# Altium schematic sheet CCS.SchDoc
size A4; SheetNumber: 1; SheetTotal: 1
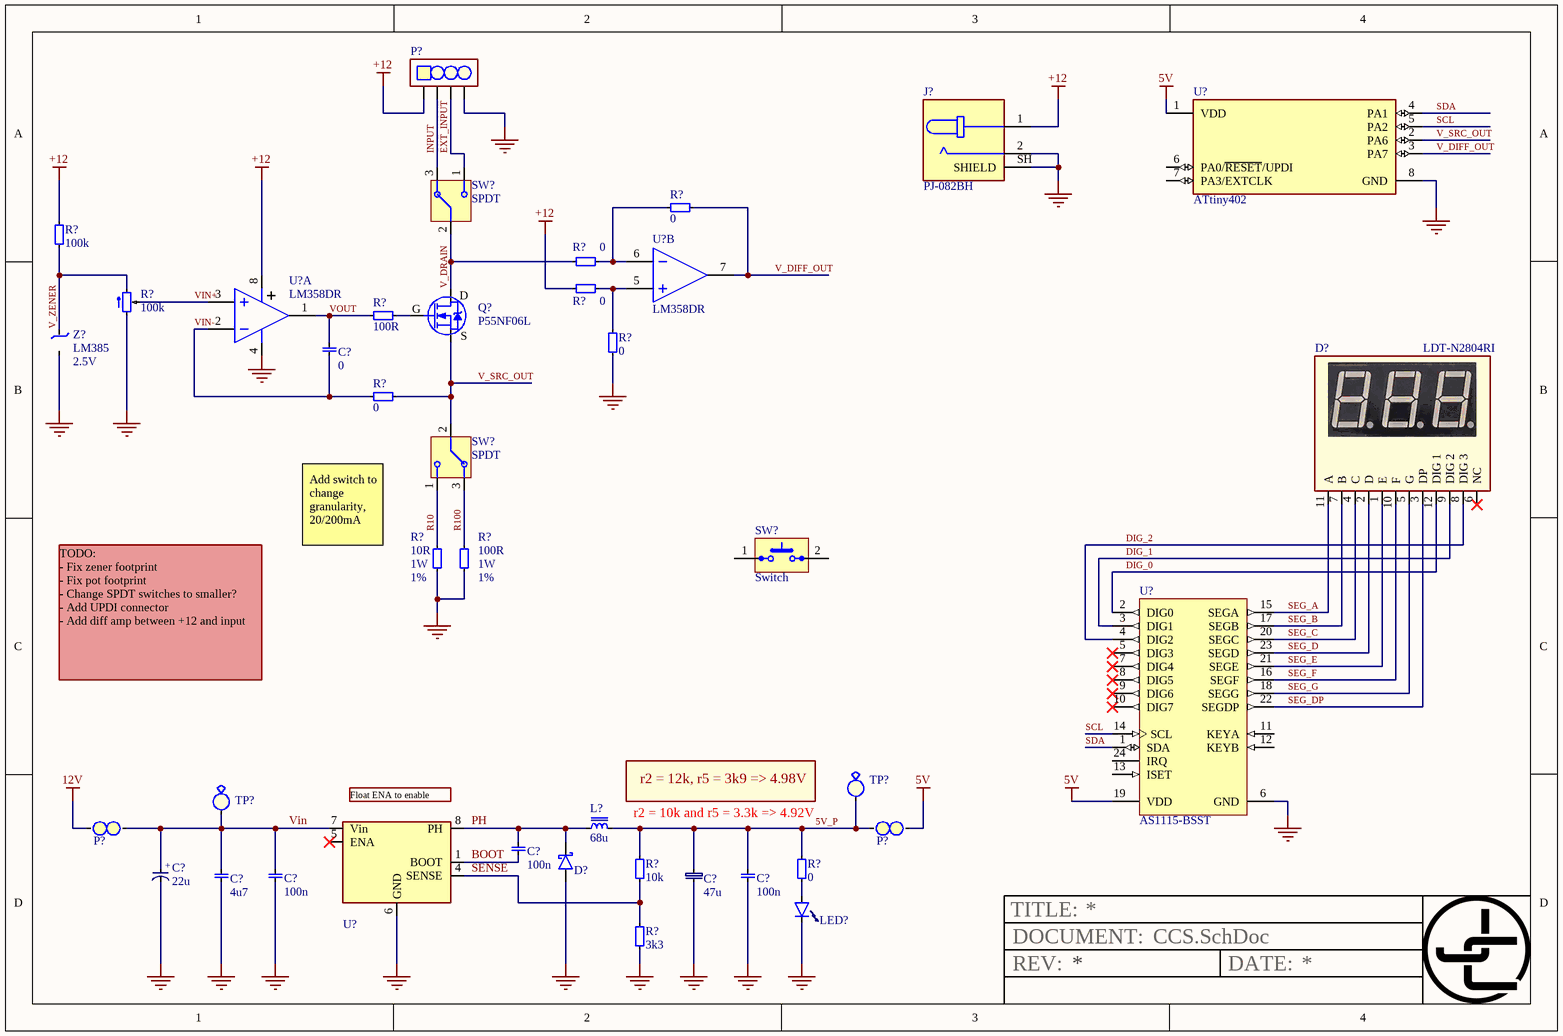
[diagram p0: CCS.SchDoc]

## Parts
(Parts that share a designator on the sheet are numbered #1, #2 ... from top to bottom, then left to right.)
C?#1  value 0  [1210, cap]  (hidden comment: 1210, capacitor)
C?#2  value 100n  [1210, cap]  (hidden comment: 1210, capacitor)
C?#3  value 22u  [EEEFT1E220AR]  (hidden comment: cap, Electrolyt Case B)
C?#4  value 4u7  [1812, cap]  (hidden comment: 1812, capacitor)
C?#5  value 100n  [1210, cap]  (hidden comment: 1210, capacitor)
C?#6  value 47u  [CASE_E]  (hidden comment: cap, Case E)
C?#7  value 100n  [1210, cap]  (hidden comment: 1210, capacitor)
D?#1  LDT-N2804RI  [7SEG_3DIGIT]
D?#2  B340A-E3/61T  [DO-214AC]  (value not drawn)
J?  PJ-082BH  [CUI_PJ-082BH]
L?  value 68u  [MSS1260]  (hidden comment: Coil, MSS1260)
LED?  0603, LED  [0603 LED]  (value not drawn)
P?#1  TBL002A-350-04GY-2GY  [4 POLE BLOCK CONNECTOR]  (value not drawn)
P?#2  1x2 Pin Heade Straight  [padtwo_L]  (value not drawn)
P?#3  1x2 Pin Heade Straight  [padtwo_L]  (value not drawn)
Q?  P55NF06L  [TO-220]
R?#1  value 0  [0603]  (hidden comment: 0603, resistor)
R?#2  value 100k  [0603]  (hidden comment: 0603, resistor)
R?#3  value 0  [0603]  (hidden comment: 0603, resistor)
R?#4  value 0  [0603]  (hidden comment: 0603, resistor)
R?#5  value 100k  [P110KH1]  (hidden comment: Potentiometer)
R?#6  value 100R  [0603]  (hidden comment: 0603, resistor)
R?#7  value 0  [0603]  (hidden comment: 0603, resistor)
R?#8  value 0  [0603]  (hidden comment: 0603, resistor)
R?#9  value 10R  Tolerance: 1%  Power: 1W  [2512, res]  (hidden comment: 2512, resistor)
R?#10  value 100R  Tolerance: 1%  Power: 1W  [2512, res]  (hidden comment: 2512, resistor)
R?#11  value 10k  [0603]  (hidden comment: 0603, resistor)
R?#12  value 0  [0603]  (hidden comment: 0603, resistor)
R?#13  value 3k3  [0603]  (hidden comment: 0603, resistor)
SW?#1  SPDT  [SW_SPDT_SMTS-102-A2]
SW?#2  SPDT  [SW_SPDT_SMTS-102-A2]
SW?#3  Switch  [SW_Tactile_2pin_P5.08mm]
TP?#1  Test Point  [testPoint]  (value not drawn)
TP?#2  Test Point  [testPoint]  (value not drawn)
U?#1  ATtiny402  [SOIC8]
U?#2  LM358DR  [SOIC8]  (part B of 2)
U?#3  LM358DR  [SOIC8]  (part A of 2)
U?#4  AS1115-BSST  [AMS-QSOP-24-8645X3900DE_M]
U?#5  TPS5410  [SOIC8]  (value not drawn)
Z?  value LM385  Reverse voltage: 2.5V  [DO-214AA]  (hidden comment: Zener Diode)

## Nets
5V: P?#3.2 U?#1.1(VDD) U?#4.19(VDD)
12V: P?#2.1
+12: J?.1 P?#1.1 R?#2.0 R?#4.1 U?#3.8(V+)
GND: C?#3.1 C?#4.0 C?#5.0 C?#6.2 C?#7.0 D?#2.2(A) J?.2 J?.SH(SHIELD) LED?.0(Cathode) P?#1.4 R?#5.1 R?#7.1 R?#9.1 R?#10.1 R?#13.1 U?#1.8(GND) U?#3.4(V-) U?#4.6(GND) U?#5.6(GND) Z?.1(Anode)
5V_P: C?#6.1 C?#7.1 L?.1 P?#3.1 R?#11.0 R?#12.0 TP?#1.0
BOOT: C?#2.0 U?#5.1(BOOT)
DIG_0: D?#1.12(DIG_1) U?#4.2(DIG0)
DIG_1: D?#1.9(DIG_2) U?#4.3(DIG1)
DIG_2: D?#1.8(DIG_3) U?#4.4(DIG2)
EXT_INPUT: P?#1.3 SW?#1.1
INPUT: P?#1.2 SW?#1.3
PH: C?#2.1 D?#2.1(K) L?.2 U?#5.8(PH)
R10: R?#9.0 SW?#2.1
R100: R?#10.0 SW?#2.3
SCL: U?#1.5(PA2) U?#4.14(SCL)
SDA: U?#1.4(PA1) U?#4.1(SDA)
SEG_A: D?#1.11(A) U?#4.15(SEGA)
SEG_B: D?#1.7(B) U?#4.17(SEGB)
SEG_C: D?#1.4(C) U?#4.20(SEGC)
SEG_D: D?#1.2(D) U?#4.23(SEGD)
SEG_DP: D?#1.3(DP) U?#4.22(SEGDP)
SEG_E: D?#1.1(E) U?#4.21(SEGE)
SEG_F: D?#1.10(F) U?#4.16(SEGF)
SEG_G: D?#1.5(G) U?#4.18(SEGG)
SENSE: R?#11.1 R?#13.0 U?#5.4(SENSE)
V_DIFF_OUT: R?#1.0 U?#1.3(PA7) U?#2.7(OUT)
V_DRAIN: Q?.2(D) R?#3.1 SW?#1.2
V_SRC_OUT: Q?.3(S) R?#8.0 SW?#2.2 U?#1.2(PA6)
V_ZENER: R?#2.1 R?#5.3 Z?.2(Cathode)
Vin: C?#3.2 C?#4.1 C?#5.1 P?#2.2 TP?#2.0 U?#5.7(Vin)
VIN+: R?#5.2 U?#3.3(IN+)
VIN-: C?#1.0 R?#8.1 U?#3.2(IN-)
VOUT: C?#1.1 R?#6.1 U?#3.1(OUT)
NetLED?_1: LED?.1 R?#12.1
NetQ?_1: Q?.1(G) R?#6.0
NetR?#1_1: R?#1.1 R?#3.0 U?#2.6(IN-)
NetR?#4_0: R?#4.0 R?#7.0 U?#2.5(IN+)

Not connected (* = marked no-connect by the designer): D?#1 6(NC)*; SW?#3 1 2; U?#1 6(PA0/~{RESET}/UPDI) 7(PA3/EXTCLK); U?#4 5(DIG3)* 7(DIG4)* 8(DIG5)* 9(DIG6)* 10(DIG7)* 11(KEYA) 12(KEYB) 13(ISET) 24(IRQ); U?#5 5(ENA)*

## Notes on the sheet
- Add switch to change granularity, 20/200mA
- TODO:
  - Fix zener footprint
  - Fix pot footprint
  - Change SPDT switches to smaller?
  - Add UPDI connector
  - Add diff amp between +12 and input
- (near TP?#1) r2 = 12k, r5 = 3k9 => 4.98V
- (near U?#5) Float ENA to enable
- r2 = 10k and r5 = 3.3k => 4.92V
- TITLE:
- REV:
- DOCUMENT:
- DATE:
- (in symbol cap, Electrolyt Case B) +

## Library data of the parts
C?#1 C?#2 C?#5 C?#7 = 1210, capacitor: Order number: 478-1556-1-ND; Supplier: Digikey
C?#4 = 1812, capacitor: Part Number: C1812C475K5RACTU; Order Number: 399-8255-1-ND
C?#6 = cap, Case E: Tantalum; Part Number: TPSE476K020R0200; Order Number: *
D?#1 = LDT-N2804RI: LED Displays & Accessories Red 3 Digit 7 segment; Manufacturer: Lumex; Manufacturer Part Number: 696-LDT-N2804RI; Forward Voltage: 2V; Element Configuration: Common Cathode; Forward Current: 10mA; Wavelength: 635nm; Power Consumption: 105mW; Luminous Intensity: 6mcd; Color: Red; Weight: 0.01lb; Min Operating Temperature: -30°C; Max Operating Temperature: 85°C; Package Quantity: 22; Illumination Color: Red; Operating Supply Voltage: 2V; Packaging: Bulk; Display Type: Segment; Length: 1inch; Width: 0.5inch; Height: 0.5inch; Reach SVHC Compliant: Yes; RoHS Compliant: Yes; Supplier 1: Mouser; Supplier Part Number 1: 696-LDT-N2804RI
D?#2 = B340A-E3/61T: SchottkydiodE, 40 V, 3 A; Value: Schottky Diode; Farnell: 2335183
J? = Power Jack: 2.5 x 6.5 mm, 10.0 A, Horizontal, Through Hole, Shielded, Dc Power Jack Connector; MF: CUI Devices; Package: None; Availability: In Stock; Value: *; MP: PJ-082BH; CUI_purchase_URL: https://www.cuidevices.com/product/interconnect/connectors/dc-power-connectors/jacks/pj-082bh?utm_source=snapeda.com&utm_medium=referral&utm_campaign=snapedaBOM; Price: None; Purchase-URL: https://pricing.snapeda.com/search/part/PJ-082BH/?ref=eda
L? = Coil, MSS1260: 68 µH, 2.3 A,; Part Number: SRR1260-680M; Order Number: *
P?#1 = 4 Pole Block Connector: 1~24 Poles, Screwless, 45°, 3.50 Pitch, 24~20 (AWG), Terminal Block Connector; Manufacturer: CUI Devices; Supplier 1: Mouser; Manufacturer Part Number: TBL002A-350-04GY-2GY; RoHS: Yes; Category: Terminal Blocks; Stock 1: 1130; Pricing 1: 1=0,94000, 10=0,45400, 50=0,45400, 100=0,43400, 1000=0,35800, 10000=0,26800 (USD); Supplier Part Number 1: 490-TBL002A3504GY2GY
P?#2 P?#3 = 1x2 Pin Heade Straight: 2.54 mm, TH; Value: 1x2 Pin Header
Q? = IRF640: N-channel Power MOSFET; Value: N Channel MOSFET; Farnell: ETF! , 8648298
SW?#1 SW?#2 = Switch SPDT: Toggle switch SPDT
SW?#3 = Tactile switch 2 pin: 2-pin tactile button switch
U?#1 = ATtiny402: MCU 8-Bit ATTINY402 AVR RISC 4KB Flash 1.8V to 5.5V 8-Pin SOIC Tray; Manufacturer: Microchip; Manufacturer Part Number: ATTINY402-SSN; Supplier 1: Mouser; RoHS: Yes; Category: Microcontrollers; Stock 1: 8731; Pricing 1: 1=0,53000, 10=0,53000, 50=0,51000, 100=0,50900, 1000=0,50900, 10000=0,50900 (USD); Supplier Part Number 1: 579-ATTINY402-SSN
U?#2 U?#3 = LM358DR: IC OPAMP GP 700KHZ 8SOIC; Manufacturer: Texas Instruments; Number of Circuits: 2; Nominal Supply Current: 1.2mA; Max Supply Voltage: 32V; Min Supply Voltage: 3V; Operating Supply Voltage: 16V; Slew Rate: 0.3V/µs; Common Mode Rejection Ratio: 65dB; Min Dual Supply Voltage: 1.5V; Output Current: 30mA; Voltage Gain: 100dB; Input Bias Current: 250nA; Input Offset Voltage (Vos): 7mV; Operating Supply Current: 1mA; Amplifier Type: GENERAL PURPOSE; Dual Supply Voltage: 9V; Supplier 1: Mouser; Manufacturer Part Number: LM358DR; RoHS: Yes; Category: Amplifiers - Op Amps, Buffer, Instrumentation; Stock 1: 281120; Pricing 1: 1=0,37000, 10=0,29900, 50=0,29900, 100=0,18500, 1000=0,11500, 10000=0,10400 (USD); Mounting Technology: Surface Mount; Case/Package: SOIC; Pins: 8; Contact Plating: Gold; Min Operating Temperature: 0°C; Max Operating Temperature: 70°C; Packaging: Tape and Reel; Number of Channels: 2; Bandwidth: 700kHz; Gain Bandwidth Product: 700kHz; Package Quantity: 2500; Supply Current: 1.2mA; Max Dual Supply Voltage: 16V; Output Current per Channel: 30mA; Series: -; Technology: BIPOLAR; Number of Elements: 2; Number of Amplifiers: 2; Unity Gain Bandwidth Product: 700kHz; Power Supply Rejection Ratio (PSRR): 65dB; Length: 4.9mm; Width: 3.91mm; Height: 1.58mm; Radiation Hardening: No; Lead Free: Lead Free; RoHS Compliant: Yes; Reach SVHC Compliant: Yes; ComponentLink1URL: https://datasheet.ciiva.com/1795/lm358-1795488.pdf?src-supplier=Digi-Key; ComponentLink1Description: https://datasheet.ciiva.com/1795/lm358-1795488.pdf?src-supplier=Digi-Key; ComponentLink2URL: https://datasheet.ciiva.com/27056/2016330-27056228.pdf?src-supplier=Jameco; ComponentLink2Description: https://datasheet.ciiva.com/27056/2016330-27056228.pdf?src-supplier=Jameco; ComponentLink3URL: https://datasheet.ciiva.com/7709/1874566-7709823.pdf?src-supplier=Element14; ComponentLink3Description: https://datasheet.ciiva.com/7709/1874566-7709823.pdf?src-supplier=Element14; ComponentLink4URL: https://datasheet.ciiva.com/46385/1874566-46385851.pdf?src-supplier=Element14; ComponentLink4Description: https://datasheet.ciiva.com/46385/1874566-46385851.pdf?src-supplier=Element14; ComponentLink5URL: https://datasheet.ciiva.com/46390/1874566-46390414.pdf?src-supplier=Element14; ComponentLink5Description: https://datasheet.ciiva.com/46390/1874566-46390414.pdf?src-supplier=Element14; ComponentLink6URL: https://datasheet.ciiva.com/1795/lm358-1795487.pdf?src-supplier=Digi-Key; ComponentLink6Description: https://datasheet.ciiva.com/1795/lm358-1795487.pdf?src-supplier=Digi-Key; ComponentLink7URL: https://datasheet.ciiva.com/1795/lm358-1795489.pdf?src-supplier=Digi-Key; ComponentLink7Description: https://datasheet.ciiva.com/1795/lm358-1795489.pdf?src-supplier=Digi-Key; ComponentLink8URL: https://datasheet.ciiva.com/2973/lm358a-2973386.pdf?src-supplier=Avnet; ComponentLink8Description: https://datasheet.ciiva.com/2973/lm358a-2973386.pdf?src-supplier=Avnet; Supplier Part Number 1: 595-LM358DR
U?#4 = AS1115-BSST: LED Driver, 7-Segment, PDSO24; Manufacturer: ams TAOS; Operating Supply Voltage: 5.5V; Interface: I2C; Max Supply Current: 350uA; Number of Segments: 7; Operating Supply Current: 335mA; Supplier 1: Rs; Manufacturer Part Number: AS1115-BSST; RoHS: Yes; Category: Integrated Circuits (ICs); Stock 1: 12488; Pricing 1: 2500=36,38100 (SEK); Case/Package: QSOP; Pins: 24; Min Operating Temperature: -40°C; Max Operating Temperature: 85°C; Packaging: Tape and Reel; Package Quantity: 2500; Lead Free: Lead Free; ComponentLink1URL: https://datasheet.ciiva.com/16291/as1115-bsst-16291524.pdf?src-supplier=Future+Electronics; ComponentLink1Description: https://datasheet.ciiva.com/16291/as1115-bsst-16291524.pdf?src-supplier=Future+Electronics; ComponentLink2URL: https://datasheet.ciiva.com/6613/as1115-datasheet-en-v2-6613782.pdf?src-supplier=Digi-Key; ComponentLink2Description: https://datasheet.ciiva.com/6613/as1115-datasheet-en-v2-6613782.pdf?src-supplier=Digi-Key; ComponentLink3URL: https://datasheet.ciiva.com/6613/as1115-datasheet-en-v2-6613783.pdf?src-supplier=Digi-Key; ComponentLink3Description: https://datasheet.ciiva.com/6613/as1115-datasheet-en-v2-6613783.pdf?src-supplier=Digi-Key; ComponentLink4URL: https://datasheet.ciiva.com/6613/as1115-datasheet-en-v2-6613784.pdf?src-supplier=Digi-Key; ComponentLink4Description: https://datasheet.ciiva.com/6613/as1115-datasheet-en-v2-6613784.pdf?src-supplier=Digi-Key; Supplier Part Number 1: 2018286; Mouser Part Number: 985-AS1115-BSST
U?#5 = TPS5410: 1-A, Wide Input Range, Step-Down Converter; Value: *; Supplier: *; Order Number: *
LED? = 0603, LED: Order Number: *
R?#5 = Potentiometer: ELFA: 300-08-353
TP?#1 TP?#2 = Test Point: Value: Test point; Farnell: 1702006